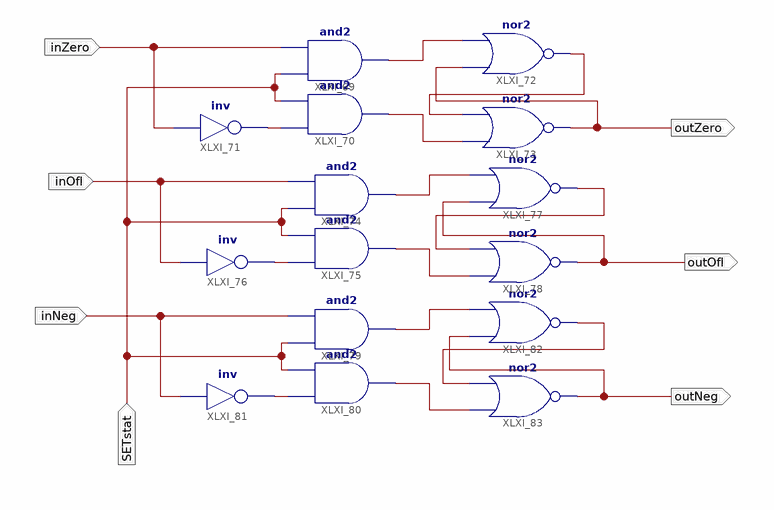
[diagram p0: schematic sheet 1]
// Xilinx ISE schematic statusREGISTER.sch (spartan3e) as structural Verilog: 15 symbols, 7 ports
module statusREGISTER (
  input  SETstat,
  input  inZero,
  input  inOfl,
  input  inNeg,
  output outZero,
  output outOfl,
  output outNeg
);

  wire XLXN_145, XLXN_147, XLXN_148, XLXN_154, XLXN_156, XLXN_157, XLXN_163, XLXN_165, XLXN_166, XLXN_182,
       XLXN_183, XLXN_184;

  nor XLXI_83 (outNeg, XLXN_166, XLXN_182);
  nor XLXI_82 (XLXN_182, outNeg, XLXN_165);
  not XLXI_81 (XLXN_163, inNeg);
  and XLXI_80 (XLXN_166, XLXN_163, SETstat);
  and XLXI_79 (XLXN_165, SETstat, inNeg);
  nor XLXI_78 (outOfl, XLXN_157, XLXN_183);
  nor XLXI_77 (XLXN_183, outOfl, XLXN_156);
  not XLXI_76 (XLXN_154, inOfl);
  and XLXI_75 (XLXN_157, XLXN_154, SETstat);
  and XLXI_74 (XLXN_156, SETstat, inOfl);
  nor XLXI_73 (outZero, XLXN_148, XLXN_184);
  nor XLXI_72 (XLXN_184, outZero, XLXN_147);
  not XLXI_71 (XLXN_145, inZero);
  and XLXI_70 (XLXN_148, XLXN_145, SETstat);
  and XLXI_69 (XLXN_147, SETstat, inZero);
endmodule
